# EAGLE schematic acms_project_starter_template (EAGLE 9.6.2)
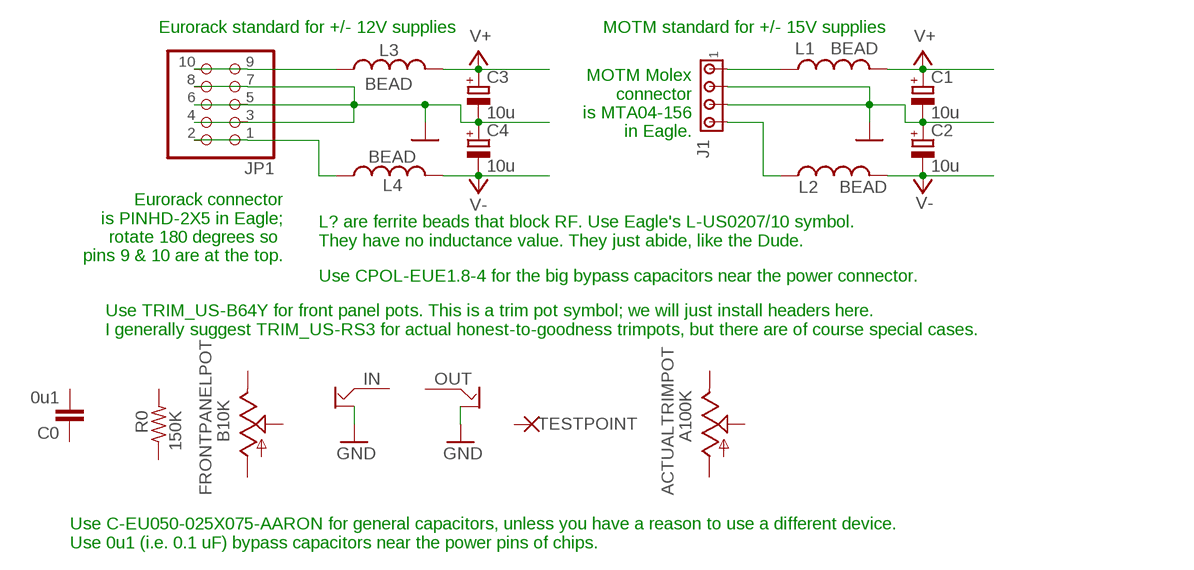
[diagram p0: schematic, sheet 1]

## Parts
ACTUALTRIMPOT  A100K  TRIM_US-RS3  [RS3]
C0  0u1  C-EU050-025X075-AARON  [C050-025X075-AARON]
C1  10u  CPOL-EUE1.8-4  [E1,8-4]
C2  10u  CPOL-EUE1.8-4  [E1,8-4]
C3  10u  CPOL-EUE1.8-4  [E1,8-4]
C4  10u  CPOL-EUE1.8-4  [E1,8-4]
FRONTPANELPOT  B10K  TRIM_US-B64Y  [B64Y]
IN  OFFBOARD2JACKALT_AARON  [OFFBOARD2JACKALT]
J1  MTA04-156  [1X4MTA]
JP1  PINHD-2X5  [2X05]
L1  BEAD  L-US0207/10  [0207/10]
L2  BEAD  L-US0207/10  [0207/10]
L3  BEAD  L-US0207/10  [0207/10]
L4  BEAD  L-US0207/10  [0207/10]
OUT  OFFBOARD2JACKALT_AARON  [OFFBOARD2JACKALT]
R0  150K  R-US_0207/10  [0207/10]
TESTPOINT  IOPAD_AARON  [ELLIPTICALPADSINGLE]

## Nets
GND: C1.- C2.+ C3.- C4.+ IN.GND J1.2 J1.3 JP1.3 JP1.4 JP1.5 JP1.6 JP1.7 JP1.8 OUT.GND
N$31: J1.1 L1.1
N$32: J1.4 L2.1
N$62: JP1.9 JP1.10 L3.1
N$63: JP1.1 JP1.2 L4.1
V+: C1.+ C3.+ L1.2 L3.2
V-: C2.- C4.- L2.2 L4.2
Unconnected: ACTUALTRIMPOT.A ACTUALTRIMPOT.E ACTUALTRIMPOT.S C0.1 C0.2 FRONTPANELPOT.A FRONTPANELPOT.E FRONTPANELPOT.S IN.SIGNAL OUT.SIGNAL R0.1 R0.2 TESTPOINT.P$1(P)

## Notes on the sheet
- Eurorack standard for +/- 12V supplies | MOTM standard for +/- 15V supplies
- MOTM Molex
  connector
  is MTA04-156
  in Eagle.
- Eurorack connector
  is PINHD-2X5 in Eagle;
  rotate 180 degrees so 
  pins 9 & 10 are at the top.
- L? are ferrite beads that block RF. Use Eagle's L-US0207/10 symbol.
  They have no inductance value. They just abide, like the Dude.
- Use CPOL-EUE1.8-4 for the big bypass capacitors near the power connector.
- Use TRIM_US-B64Y for front panel pots. This is a trim pot symbol; we will just install headers here.
  I generally suggest TRIM_US-RS3 for actual honest-to-goodness trimpots, but there are of course special cases.
- Use C-EU050-025X075-AARON for general capacitors, unless you have a reason to use a different device.
  Use 0u1 (i.e. 0.1 uF) bypass capacitors near the power pins of chips.

## Library data of the parts
ACTUALTRIMPOT FRONTPANELPOT = pot:TRIM_US-: POTENTIOMETER
C0 = aaroncaps:C-EU: CAPACITOR, European symbol
C1-C4 = rcl:CPOL-EU: POLARIZED CAPACITOR, European symbol
IN OUT = aaronlibrary:OFFBOARD2JACKALT_AARON
J1 = con-amp:MTA04-156: AMP connector
JP1 = pinhead:PINHD-2X5: PIN HEADER
L1-L4 = rcl:L-US: INDUCTOR, American symbol; SPICEPREFIX: L
R0 = rcl:R-US_: RESISTOR, American symbol
TESTPOINT = aaronlibrary:IOPAD_AARON